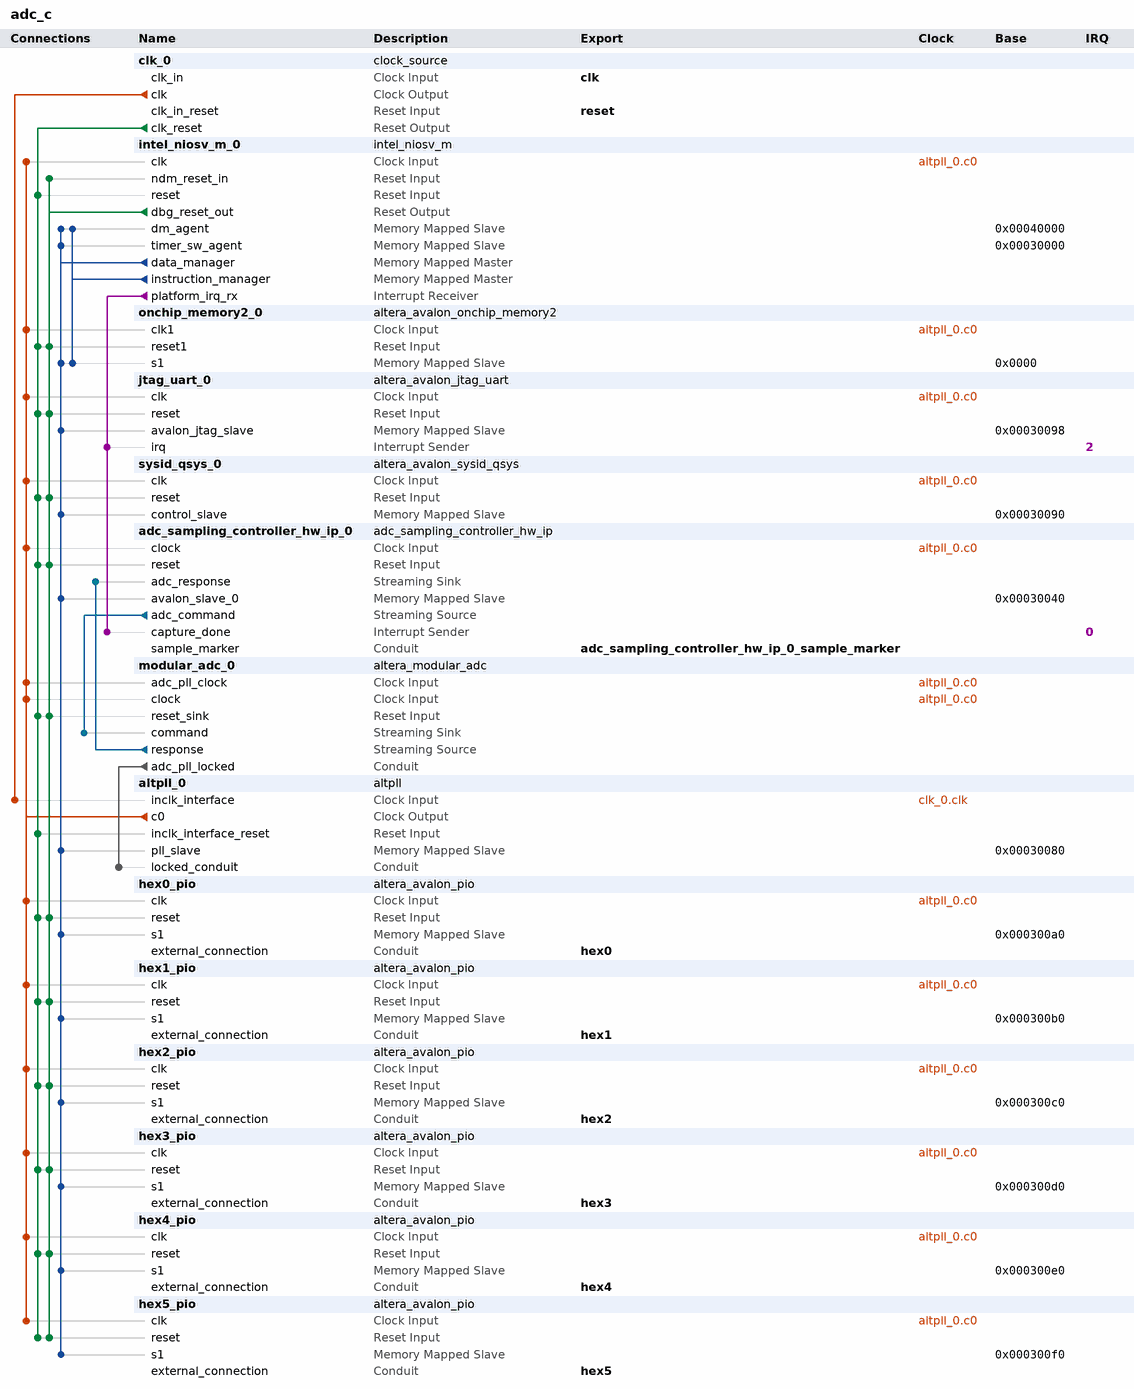
[diagram p0: system contents]
# Platform Designer (Qsys) system adc_c, MAX 10 10M50DAF484C7G
# Parameters at their usual value, and those the tool derives, are not listed.
package require -exact qsys 25.1
create_system adc_c
set_project_property DEVICE_FAMILY {MAX 10}
set_project_property DEVICE 10M50DAF484C7G

add_instance clk_0 clock_source 25.1
set_instance_parameter_value clk_0 clockFrequency 50000000

add_instance intel_niosv_m_0 intel_niosv_m 26.0.0
set_instance_parameter_value intel_niosv_m_0 clockFrequency 10000000
set_instance_parameter_value intel_niosv_m_0 enableAvalonInterface false
set_instance_parameter_value intel_niosv_m_0 enableDebugReset true
set_instance_parameter_value intel_niosv_m_0 enableECCFull false
set_instance_parameter_value intel_niosv_m_0 enableECCLite false
set_instance_parameter_value intel_niosv_m_0 hartId 0
set_instance_parameter_value intel_niosv_m_0 interruptMode 0
set_instance_parameter_value intel_niosv_m_0 pipelineArch true
set_instance_parameter_value intel_niosv_m_0 resetSlave onchip_memory2_0.s1

add_instance onchip_memory2_0 altera_avalon_onchip_memory2 25.1
set_instance_parameter_value onchip_memory2_0 dataWidth 32
set_instance_parameter_value onchip_memory2_0 dualPort false
set_instance_parameter_value onchip_memory2_0 initMemContent false
set_instance_parameter_value onchip_memory2_0 initializationFileName onchip_mem.hex
set_instance_parameter_value onchip_memory2_0 memorySize 122880

add_instance jtag_uart_0 altera_avalon_jtag_uart 25.1
set_instance_parameter_value jtag_uart_0 simInteractiveOptions NO_INTERACTIVE_WINDOWS

add_instance sysid_qsys_0 altera_avalon_sysid_qsys 25.1
set_instance_parameter_value sysid_qsys_0 id 0

add_instance adc_sampling_controller_hw_ip_0 adc_sampling_controller_hw_ip 1.0
set_instance_parameter_value adc_sampling_controller_hw_ip_0 ADC_CHAN_WIDTH 5
set_instance_parameter_value adc_sampling_controller_hw_ip_0 ADC_DATA_WIDTH 12
set_instance_parameter_value adc_sampling_controller_hw_ip_0 BUFFER_ADDR_W 10
set_instance_parameter_value adc_sampling_controller_hw_ip_0 BUFFER_DEPTH 1024

add_instance modular_adc_0 altera_modular_adc 25.1
set_instance_parameter_value modular_adc_0 CLOCK_FREQ 10000000
set_instance_parameter_value modular_adc_0 CORE_VAR 3
set_instance_parameter_value modular_adc_0 DEVICE_PART 10M50DAF484C7G
set_instance_parameter_value modular_adc_0 clkdiv 2
set_instance_parameter_value modular_adc_0 int_vref_vr 3.0
set_instance_parameter_value modular_adc_0 refsel 1
set_instance_parameter_value modular_adc_0 sample_rate 0
set_instance_parameter_value modular_adc_0 seq_order_length 1
set_instance_parameter_value modular_adc_0 seq_order_slot_1 1
set_instance_parameter_value modular_adc_0 seq_order_slot_2 30
set_instance_parameter_value modular_adc_0 seq_order_slot_3 30
set_instance_parameter_value modular_adc_0 seq_order_slot_4 30
set_instance_parameter_value modular_adc_0 seq_order_slot_5 30
set_instance_parameter_value modular_adc_0 seq_order_slot_6 30
set_instance_parameter_value modular_adc_0 seq_order_slot_7 30
set_instance_parameter_value modular_adc_0 use_ch0 false
set_instance_parameter_value modular_adc_0 use_ch2 true
set_instance_parameter_value modular_adc_0 use_ch3 true
set_instance_parameter_value modular_adc_0 use_ch4 true
set_instance_parameter_value modular_adc_0 use_ch5 true
set_instance_parameter_value modular_adc_0 use_ch6 true
set_instance_parameter_value modular_adc_0 use_ch7 false
set_instance_parameter_value modular_adc_0 use_ch8 false
set_instance_parameter_value modular_adc_0 use_tsd false

add_instance altpll_0 altpll 25.1
set_instance_parameter_value altpll_0 CLK0_DIVIDE_BY 5
set_instance_parameter_value altpll_0 CLK0_MULTIPLY_BY 1
set_instance_parameter_value altpll_0 INCLK0_INPUT_FREQUENCY 20000
set_instance_parameter_value altpll_0 PORT_ARESET PORT_UNUSED
set_instance_parameter_value altpll_0 PORT_LOCKED PORT_USED
set_instance_parameter_value altpll_0 PORT_clk1 PORT_UNUSED
set_instance_parameter_value altpll_0 PORT_clk2 PORT_UNUSED
set_instance_parameter_value altpll_0 PORT_clk3 PORT_UNUSED

add_instance hex0_pio altera_avalon_pio 25.1
set_instance_parameter_value hex0_pio direction Output
set_instance_parameter_value hex0_pio width 8

add_instance hex1_pio altera_avalon_pio 25.1
set_instance_parameter_value hex1_pio direction Output
set_instance_parameter_value hex1_pio width 8

add_instance hex2_pio altera_avalon_pio 25.1
set_instance_parameter_value hex2_pio direction Output
set_instance_parameter_value hex2_pio width 8

add_instance hex3_pio altera_avalon_pio 25.1
set_instance_parameter_value hex3_pio direction Output
set_instance_parameter_value hex3_pio width 8

add_instance hex4_pio altera_avalon_pio 25.1
set_instance_parameter_value hex4_pio direction Output
set_instance_parameter_value hex4_pio width 8

add_instance hex5_pio altera_avalon_pio 25.1
set_instance_parameter_value hex5_pio direction Output
set_instance_parameter_value hex5_pio width 8

# connections
add_connection altpll_0.c0 adc_sampling_controller_hw_ip_0.clock clock
add_connection altpll_0.c0 hex0_pio.clk clock
add_connection altpll_0.c0 hex1_pio.clk clock
add_connection altpll_0.c0 hex2_pio.clk clock
add_connection altpll_0.c0 hex3_pio.clk clock
add_connection altpll_0.c0 hex4_pio.clk clock
add_connection altpll_0.c0 hex5_pio.clk clock
add_connection altpll_0.c0 intel_niosv_m_0.clk clock
add_connection altpll_0.c0 jtag_uart_0.clk clock
add_connection altpll_0.c0 modular_adc_0.adc_pll_clock clock
add_connection altpll_0.c0 modular_adc_0.clock clock
add_connection altpll_0.c0 onchip_memory2_0.clk1 clock
add_connection altpll_0.c0 sysid_qsys_0.clk clock
add_connection clk_0.clk altpll_0.inclk_interface clock
add_connection clk_0.clk_reset adc_sampling_controller_hw_ip_0.reset reset
add_connection clk_0.clk_reset altpll_0.inclk_interface_reset reset
add_connection clk_0.clk_reset hex0_pio.reset reset
add_connection clk_0.clk_reset hex1_pio.reset reset
add_connection clk_0.clk_reset hex2_pio.reset reset
add_connection clk_0.clk_reset hex3_pio.reset reset
add_connection clk_0.clk_reset hex4_pio.reset reset
add_connection clk_0.clk_reset hex5_pio.reset reset
add_connection clk_0.clk_reset intel_niosv_m_0.reset reset
add_connection clk_0.clk_reset jtag_uart_0.reset reset
add_connection clk_0.clk_reset modular_adc_0.reset_sink reset
add_connection clk_0.clk_reset onchip_memory2_0.reset1 reset
add_connection clk_0.clk_reset sysid_qsys_0.reset reset
add_connection intel_niosv_m_0.dbg_reset_out adc_sampling_controller_hw_ip_0.reset reset
add_connection intel_niosv_m_0.dbg_reset_out hex0_pio.reset reset
add_connection intel_niosv_m_0.dbg_reset_out hex1_pio.reset reset
add_connection intel_niosv_m_0.dbg_reset_out hex2_pio.reset reset
add_connection intel_niosv_m_0.dbg_reset_out hex3_pio.reset reset
add_connection intel_niosv_m_0.dbg_reset_out hex4_pio.reset reset
add_connection intel_niosv_m_0.dbg_reset_out hex5_pio.reset reset
add_connection intel_niosv_m_0.dbg_reset_out intel_niosv_m_0.ndm_reset_in reset
add_connection intel_niosv_m_0.dbg_reset_out jtag_uart_0.reset reset
add_connection intel_niosv_m_0.dbg_reset_out modular_adc_0.reset_sink reset
add_connection intel_niosv_m_0.dbg_reset_out onchip_memory2_0.reset1 reset
add_connection intel_niosv_m_0.dbg_reset_out sysid_qsys_0.reset reset
add_connection intel_niosv_m_0.data_manager adc_sampling_controller_hw_ip_0.avalon_slave_0 avalon
set_connection_parameter_value intel_niosv_m_0.data_manager/adc_sampling_controller_hw_ip_0.avalon_slave_0 baseAddress 0x00030040
add_connection intel_niosv_m_0.data_manager altpll_0.pll_slave avalon
set_connection_parameter_value intel_niosv_m_0.data_manager/altpll_0.pll_slave baseAddress 0x00030080
add_connection intel_niosv_m_0.data_manager hex0_pio.s1 avalon
set_connection_parameter_value intel_niosv_m_0.data_manager/hex0_pio.s1 baseAddress 0x000300a0
add_connection intel_niosv_m_0.data_manager hex1_pio.s1 avalon
set_connection_parameter_value intel_niosv_m_0.data_manager/hex1_pio.s1 baseAddress 0x000300b0
add_connection intel_niosv_m_0.data_manager hex2_pio.s1 avalon
set_connection_parameter_value intel_niosv_m_0.data_manager/hex2_pio.s1 baseAddress 0x000300c0
add_connection intel_niosv_m_0.data_manager hex3_pio.s1 avalon
set_connection_parameter_value intel_niosv_m_0.data_manager/hex3_pio.s1 baseAddress 0x000300d0
add_connection intel_niosv_m_0.data_manager hex4_pio.s1 avalon
set_connection_parameter_value intel_niosv_m_0.data_manager/hex4_pio.s1 baseAddress 0x000300e0
add_connection intel_niosv_m_0.data_manager hex5_pio.s1 avalon
set_connection_parameter_value intel_niosv_m_0.data_manager/hex5_pio.s1 baseAddress 0x000300f0
add_connection intel_niosv_m_0.data_manager intel_niosv_m_0.dm_agent avalon
set_connection_parameter_value intel_niosv_m_0.data_manager/intel_niosv_m_0.dm_agent baseAddress 0x00040000
add_connection intel_niosv_m_0.data_manager intel_niosv_m_0.timer_sw_agent avalon
set_connection_parameter_value intel_niosv_m_0.data_manager/intel_niosv_m_0.timer_sw_agent baseAddress 0x00030000
add_connection intel_niosv_m_0.data_manager jtag_uart_0.avalon_jtag_slave avalon
set_connection_parameter_value intel_niosv_m_0.data_manager/jtag_uart_0.avalon_jtag_slave baseAddress 0x00030098
add_connection intel_niosv_m_0.data_manager onchip_memory2_0.s1 avalon
set_connection_parameter_value intel_niosv_m_0.data_manager/onchip_memory2_0.s1 baseAddress 0x0000
add_connection intel_niosv_m_0.data_manager sysid_qsys_0.control_slave avalon
set_connection_parameter_value intel_niosv_m_0.data_manager/sysid_qsys_0.control_slave baseAddress 0x00030090
add_connection intel_niosv_m_0.instruction_manager intel_niosv_m_0.dm_agent avalon
set_connection_parameter_value intel_niosv_m_0.instruction_manager/intel_niosv_m_0.dm_agent baseAddress 0x00040000
add_connection intel_niosv_m_0.instruction_manager onchip_memory2_0.s1 avalon
set_connection_parameter_value intel_niosv_m_0.instruction_manager/onchip_memory2_0.s1 baseAddress 0x0000
add_connection adc_sampling_controller_hw_ip_0.adc_command modular_adc_0.command avalon_streaming
add_connection modular_adc_0.response adc_sampling_controller_hw_ip_0.adc_response avalon_streaming
add_connection modular_adc_0.adc_pll_locked altpll_0.locked_conduit conduit
add_connection intel_niosv_m_0.platform_irq_rx adc_sampling_controller_hw_ip_0.capture_done interrupt
set_connection_parameter_value intel_niosv_m_0.platform_irq_rx/adc_sampling_controller_hw_ip_0.capture_done irqNumber 0
add_connection intel_niosv_m_0.platform_irq_rx jtag_uart_0.irq interrupt
set_connection_parameter_value intel_niosv_m_0.platform_irq_rx/jtag_uart_0.irq irqNumber 2

# exported interfaces
add_interface adc_sampling_controller_hw_ip_0_sample_marker conduit end
set_interface_property adc_sampling_controller_hw_ip_0_sample_marker EXPORT_OF adc_sampling_controller_hw_ip_0.sample_marker
add_interface clk clock sink
set_interface_property clk EXPORT_OF clk_0.clk_in
add_interface hex0 conduit end
set_interface_property hex0 EXPORT_OF hex0_pio.external_connection
add_interface hex1 conduit end
set_interface_property hex1 EXPORT_OF hex1_pio.external_connection
add_interface hex2 conduit end
set_interface_property hex2 EXPORT_OF hex2_pio.external_connection
add_interface hex3 conduit end
set_interface_property hex3 EXPORT_OF hex3_pio.external_connection
add_interface hex4 conduit end
set_interface_property hex4 EXPORT_OF hex4_pio.external_connection
add_interface hex5 conduit end
set_interface_property hex5 EXPORT_OF hex5_pio.external_connection
add_interface reset reset sink
set_interface_property reset EXPORT_OF clk_0.clk_in_reset

set_interconnect_requirement {$system} qsys_mm.clockCrossingAdapter HANDSHAKE
set_interconnect_requirement {$system} qsys_mm.enableEccProtection FALSE
set_interconnect_requirement {$system} qsys_mm.insertDefaultSlave FALSE
set_interconnect_requirement {$system} qsys_mm.maxAdditionalLatency 1

save_system adc_c.qsys
